# Altium project thesis_debug_board.PrjPcb
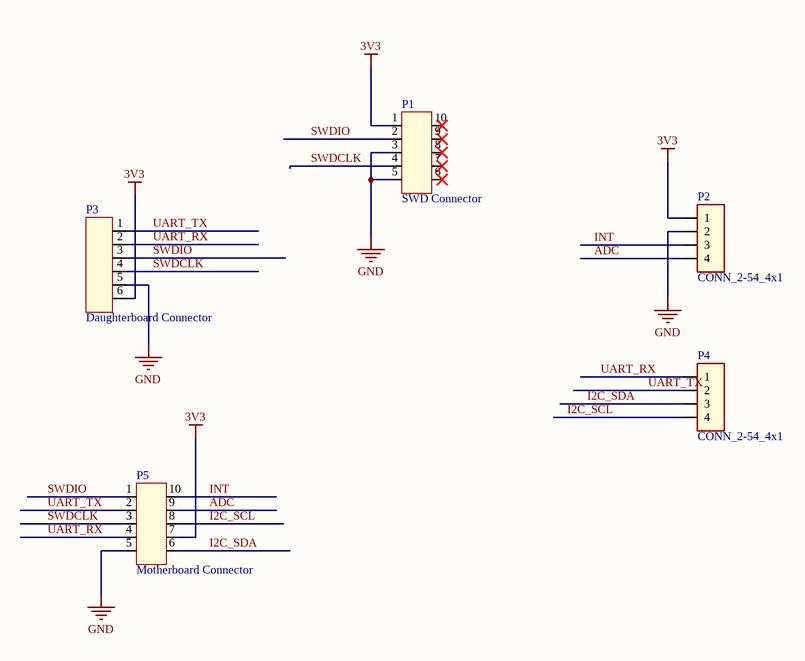
[diagram p0: debug_board.SchDoc]
1 sheet, 5 parts. Net scope: global (net labels, ports and power ports of the same name join across sheets).
Board file: debug_board.PcbDoc

## Sheet debug_board.SchDoc
size A4; SheetNumber: 1; SheetTotal: 1

### Parts
P1  SWD Connector  [1_27-5x2 Female Right Angle]
P2  CONN_2-54_4x1  [2_54-4x1_FEMALE_HEADER_THT]
P3  Daughterboard Connector  [1_27-6x1-MALE_HEADER_RIGHT_THT]
P4  CONN_2-54_4x1  [2_54-4x1_FEMALE_HEADER_THT]
P5  Motherboard Connector  [1_27-5x2 Female Right Angle]

### Nets
3V3: P1.1 P2.1 P3.6 P5.7
GND: P1.3 P1.5 P2.2 P3.5 P5.5
ADC: P2.4 P5.9
I2C_SCL: P4.4 P5.8
I2C_SDA: P4.3 P5.6
INT: P2.3 P5.10
SWDCLK: P1.4 P3.4 P5.3
SWDIO: P1.2 P3.3 P5.1
UART_RX: P3.2 P4.1 P5.4
UART_TX: P3.1 P4.2 P5.2

Not connected (* = marked no-connect by the designer): P1 6* 7* 8* 9* 10*

### Library data of the parts
P1 P5 = CONN_1-27_5x2: 1.27mm pitch 5x2 pin male connector
P3 = CONN_1-26_6x1: System: Connector